# EAGLE design Grove - Mini Track ball v1.0 (EAGLE 7.2.0)

## Sheet 1 of 2
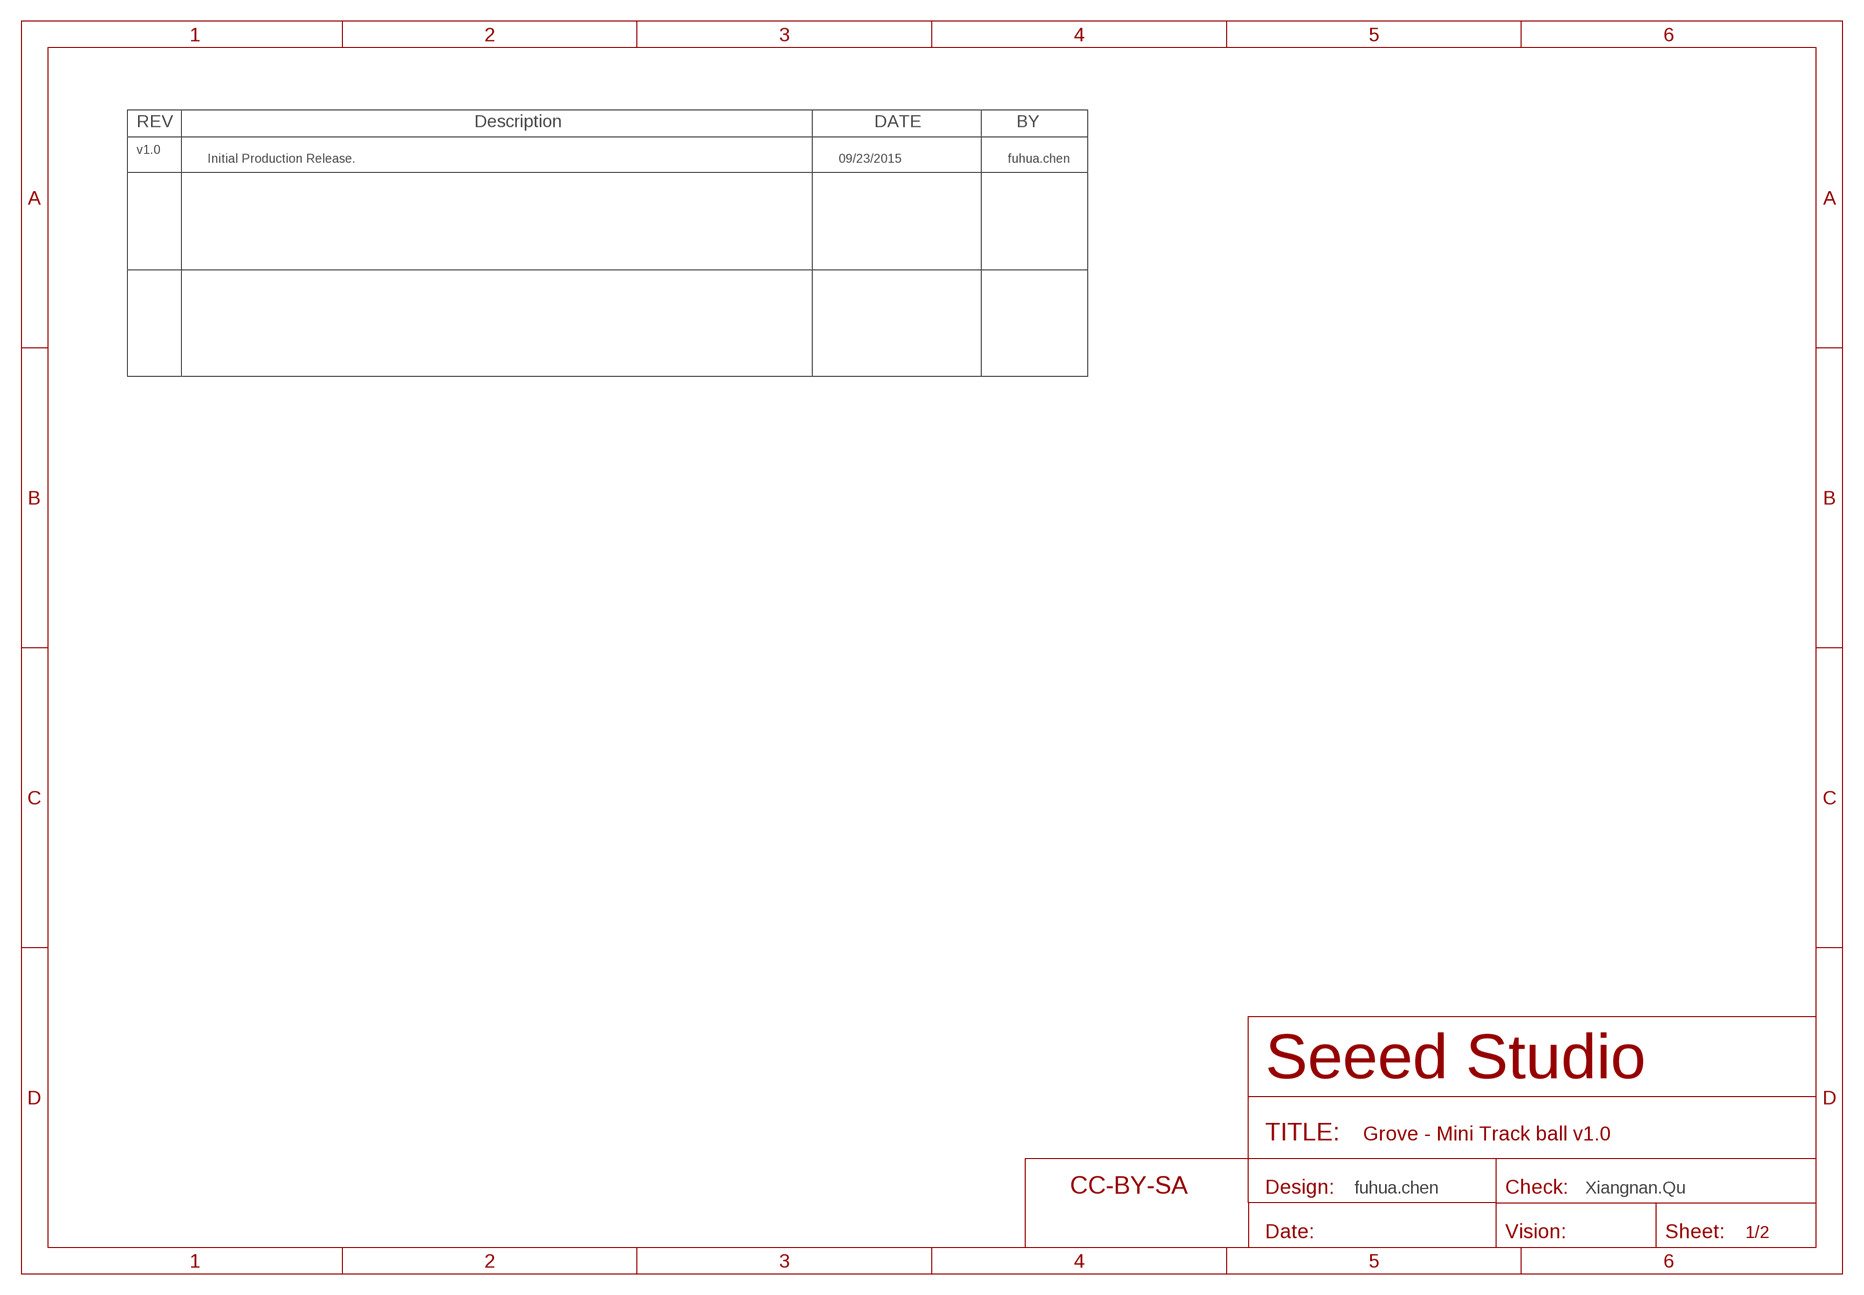
[diagram p0: schematic, sheet 1]

### Parts
U$13  SEEEDSTUDIO-OPEN-SCH-FRAME  [SEEEDSTUDIO-PCB-FRAME]

### Notes on the sheet
- REV | Description | DATE | BY
- v1.0
- Initial Production Release. | 09/23/2015 | fuhua.chen
- fuhua.chen | Xiangnan.Qu

## Sheet 2 of 2
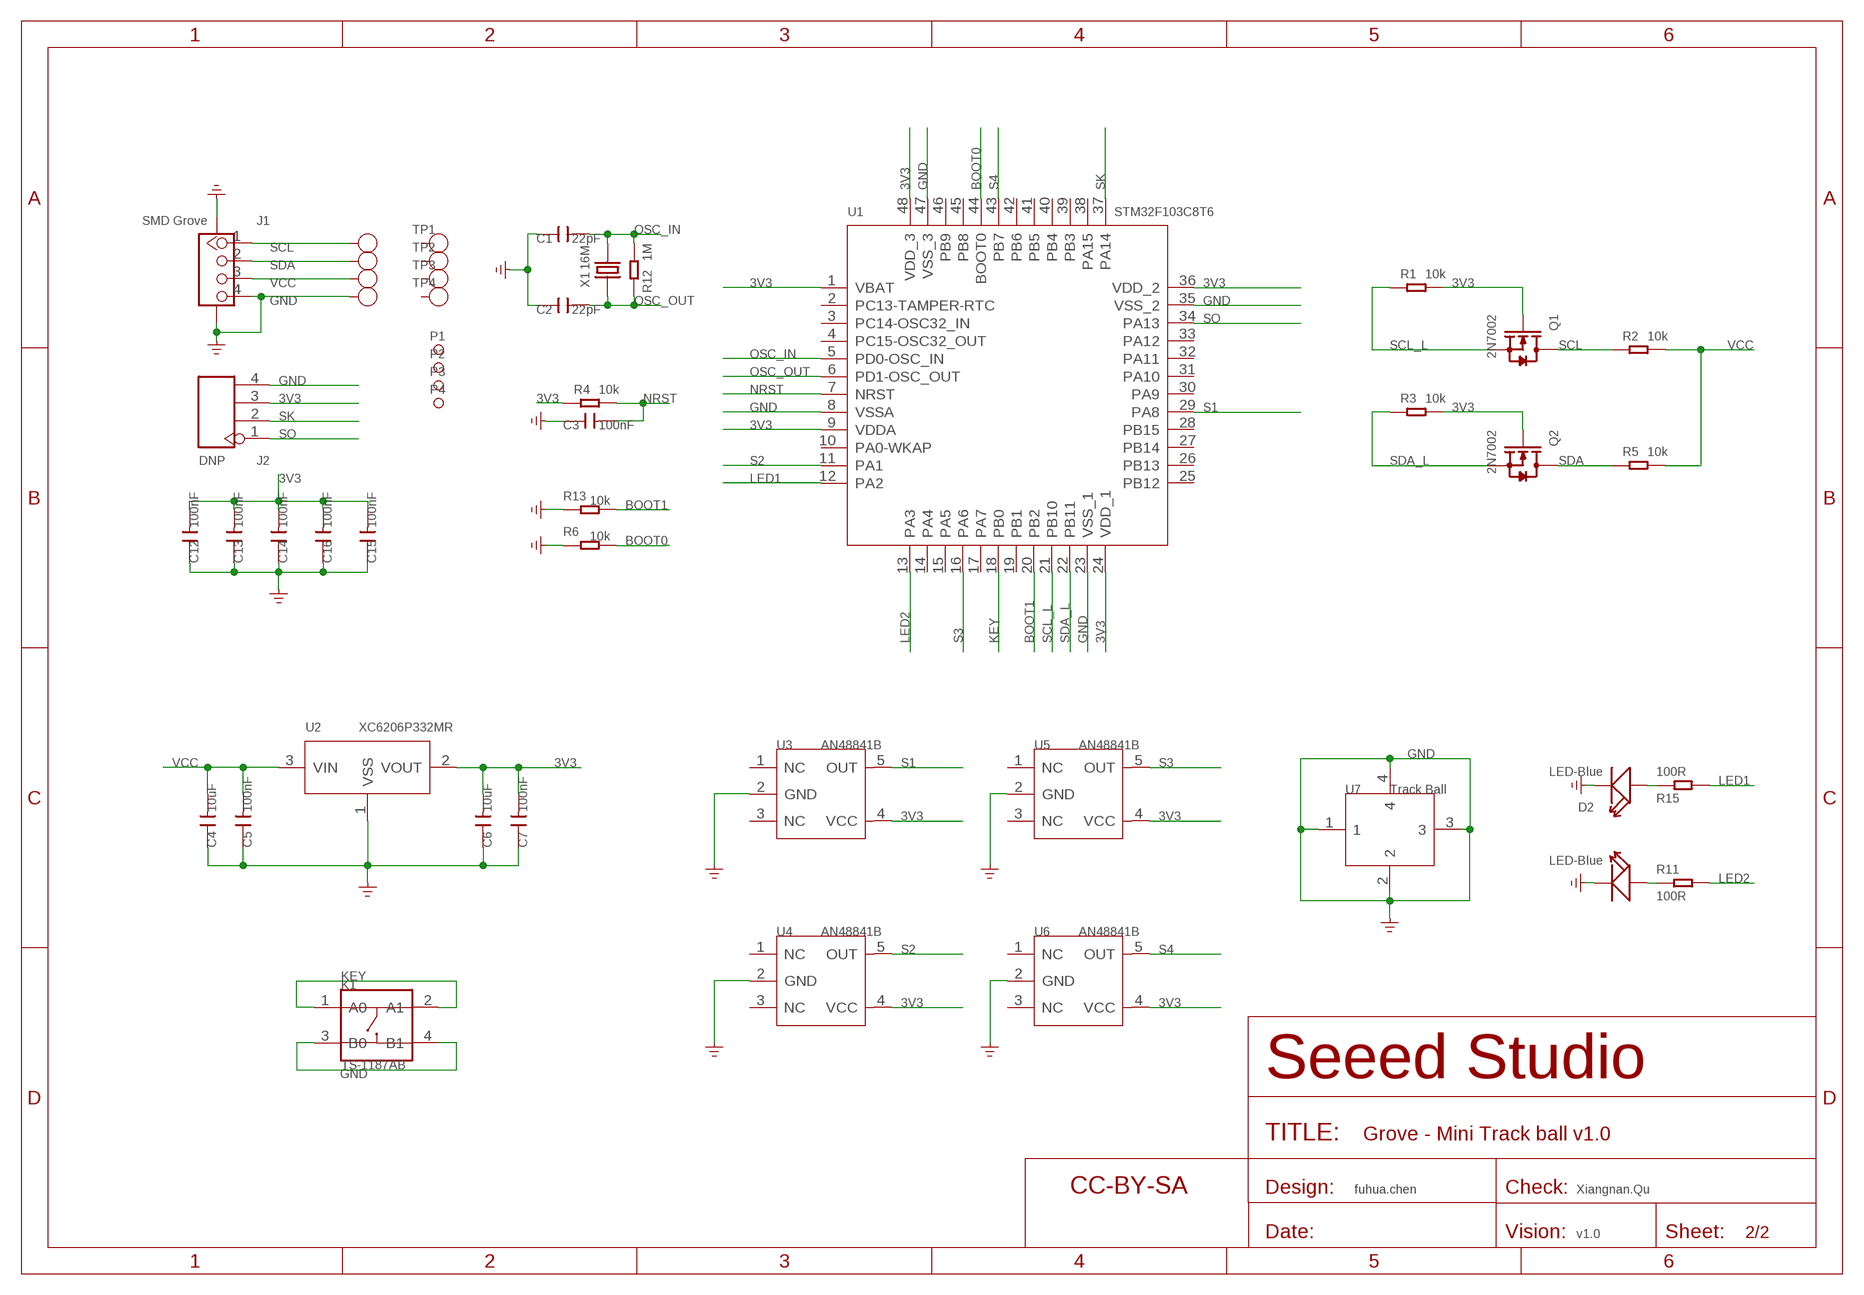
[diagram p1: schematic, sheet 2]

### Parts
C1  22pF  CAP-0402  [C0402]
C2  22pF  CAP-0402  [C0402]
C3  100nF  CAP-0402  [C0402]
C4  10uF  CAP-0402  [C0402]
C5  100nF  CAP-0402  [C0402]
C6  10uF  CAP-0402  [C0402]
C7  100nF  CAP-0402  [C0402]
C12  100nF  CAP-0402  [C0402]
C13  100nF  CAP-0402  [C0402]
C14  100nF  CAP-0402  [C0402]
C15  100nF  CAP-0402  [C0402]
C16  100nF  CAP-0402  [C0402]
D1  LED-Blue  LED'0402'  [LED-0402]
D2  LED-Blue  LED'0402'  [LED-0402]
FR  SEEEDSTUDIO-OPEN-SCH-FRAME  [SEEEDSTUDIO-PCB-FRAME]
GND  GND  TEST-POINT'4545'  [TP-D45MIL]
J1  SMD Grove  GROVE-CONNECTOR-SMD'90D'  [HW4-SMD-2.0-90D]
J2  DNP  HEADER-4P-65/35MIL  [H4-2.54]
K1  TS-1187AB  BUTTON-4P-4.5X4.5  [SW4-4.5X4.5X0.5MM]
P1  MARK-1.0'ANNULAR'  [ROUND-MARK-1.0]
P2  MARK-1.0'ANNULAR'  [ROUND-MARK-1.0]
P3  MARK-1.0'ANNULAR'  [ROUND-MARK-1.0]
P4  MARK-1.0'ANNULAR'  [ROUND-MARK-1.0]
Q1  2N7002  MOSFET-N'SOT23'  [SOT-23]
Q2  2N7002  MOSFET-N'SOT23'  [SOT-23]
R1  10k  RES-0402  [R0402]
R2  10k  RES-0402  [R0402]
R3  10k  RES-0402  [R0402]
R4  10k  RES-0402  [R0402]
R5  10k  RES-0402  [R0402]
R6  10k  RES-0402  [R0402]
R11  100R  RES-0402  [R0402]
R12  1M  RES-0402  [R0402]
R13  10k  RES-0402  [R0402]
R15  100R  RES-0402  [R0402]
SCL  SCL  TEST-POINT'4545'  [TP-D45MIL]
SDA  SDA  TEST-POINT'4545'  [TP-D45MIL]
TP1  TEST-POINT'4545'  [TP-D45MIL]
TP2  TEST-POINT'4545'  [TP-D45MIL]
TP3  TEST-POINT'4545'  [TP-D45MIL]
TP4  TEST-POINT'4545'  [TP-D45MIL]
U1  STM32F103C8T6  MCU-STM32F103CBT6  [LQFP48]
U2  XC6206P332MR  PMIC-XC6206PMR  [SOT-23]
U3  AN48841B  SENSOR-AN48841B  [SMINI-5DE]
U4  AN48841B  SENSOR-AN48841B  [SMINI-5DE]
U5  AN48841B  SENSOR-AN48841B  [SMINI-5DE]
U6  AN48841B  SENSOR-AN48841B  [SMINI-5DE]
U7  Track Ball  TRACK-BALL  [BALL4P-9.1X9.1X6.04MM]
VCC  VCC  TEST-POINT'4545'  [TP-D45MIL]
X1  16M  CRYSTAL-2P'3225'  [X4-SMD-3.2X2.5X0.7MM]

### Nets
3V3: C6.2 C7.2 C12.2 C13.2 C14.2 C15.2 C16.2 J2.3 Q1.1(G) Q2.1(G) R1.2 R3.2 R4.1 U1.1(VBAT) U1.9(VDDA) U1.24(VDD_1) U1.36(VDD_2) U1.48(VDD_3) U2.2(VOUT) U3.4(VCC) U4.4(VCC) U5.4(VCC) U6.4(VCC)
BOOT0: R6.2 U1.44(BOOT0)
BOOT1: R13.2 U1.20(PB2)
GND: C1.1 C2.1 C3.1 C4.1 C5.1 C6.1 C7.1 C12.1 C13.1 C14.1 C15.1 C16.1 D1.- D2.- GND.T J1.4 J1.SS1 J1.SS2 J2.4 K1.3(B0) K1.4(B1) R6.1 R13.1 U1.8(VSSA) U1.23(VSS_1) U1.35(VSS_2) U1.47(VSS_3) U2.1(VSS) U3.2(GND) U4.2(GND) U5.2(GND) U6.2(GND) U7.1 U7.2 U7.3 U7.4 ; supply symbol labelled GND_POWER
KEY: K1.1(A0) K1.2(A1) U1.18(PB0)
LED1: R15.2 U1.12(PA2)
LED2: R11.2 U1.13(PA3)
N$1: D1.+ R11.1
N$4: D2.+ R15.1
NRST: C3.2 R4.2 U1.7(NRST)
OSC_IN: C1.2 R12.2 U1.5(PD0-OSC_IN) X1.4
OSC_OUT: C2.2 R12.1 U1.6(PD1-OSC_OUT) X1.2
S1: U1.29(PA8) U3.5(OUT)
S2: U1.11(PA1) U4.5(OUT)
S3: U1.16(PA6) U5.5(OUT)
S4: U1.43(PB7) U6.5(OUT)
SCL: J1.1 Q1.3(D) R2.1 SCL.T
SCL_L: Q1.2(S) R1.1 U1.21(PB10)
SDA: J1.2 Q2.3(D) R5.1 SDA.T
SDA_L: Q2.2(S) R3.1 U1.22(PB11)
SK: J2.2 U1.37(PA14)
SO: J2.1 U1.34(PA13)
VCC: C4.2 C5.2 J1.3 R2.2 R5.2 U2.3(VIN) VCC.T
Unconnected: TP1.T TP2.T TP3.T TP4.T U1.2(PC13-TAMPER-RTC) U1.3(PC14-OSC32_IN) U1.4(PC15-OSC32_OUT) U1.10(PA0-WKAP) U1.14(PA4) U1.15(PA5) U1.17(PA7) U1.19(PB1) U1.25(PB12) U1.26(PB13) U1.27(PB14) U1.28(PB15) U1.30(PA9) U1.31(PA10) U1.32(PA11) U1.33(PA12) U1.38(PA15) U1.39(PB3) U1.40(PB4) U1.41(PB5) U1.42(PB6) U1.45(PB8) U1.46(PB9) U3.1(NC) U3.3(NC) U4.1(NC) U4.3(NC) U5.1(NC) U5.3(NC) U6.1(NC) U6.3(NC)

### Notes on the sheet
- fuhua.chen | Xiangnan.Qu
- v1.0

## Library data of the parts
C1-C7 C12-C16 = Discrete-new:CAP: Ceramic Capacitors
D1 D2 = Discrete-new:LED
FR U$13 = moudle-new:SEEEDSTUDIO-OPEN-SCH-FRAME
GND SCL SDA TP1-TP4 VCC = Discrete-new:TEST-POINT; PARTNO: DNP
J1 = Connector-new:GROVE-CONNECTOR-SMD: 4P-SMD-2.0:320110030;4P-SMD-2.0-90D:320110032
J2 = Connector-new:HEADER-4P
K1 = Discrete-new:BUTTON-4P: SW4-6.0X6.0X5.0MM:311020024;SW4-8.0X8.0X9.0MM:311020028;SW4-SMD-6.0X6.0X5.0MM:311020004;SW4-SMD-3.35X3.35X1.5MM:311020030;SW4-SMD-5.2X5.2X2.5MM:311020046
P1-P4 = Discrete-new:MARK-1.0; PARTNO: DNP
Q1 Q2 = Discrete-new:MOSFET-N
R1-R6 R11-R13 R15 = Discrete-new:RES
U1 = IC-new:MCU-STM32F103CBT6: 310010004
U2 = IC-new:PMIC-XC6206P: LOW ESR Cap.Compatible Positive Voltage Regulators
U3-U6 = template:SENSOR-AN48841B
U7 = template:TRACK-BALL
X1 = Discrete-new:CRYSTAL-2P

## Board
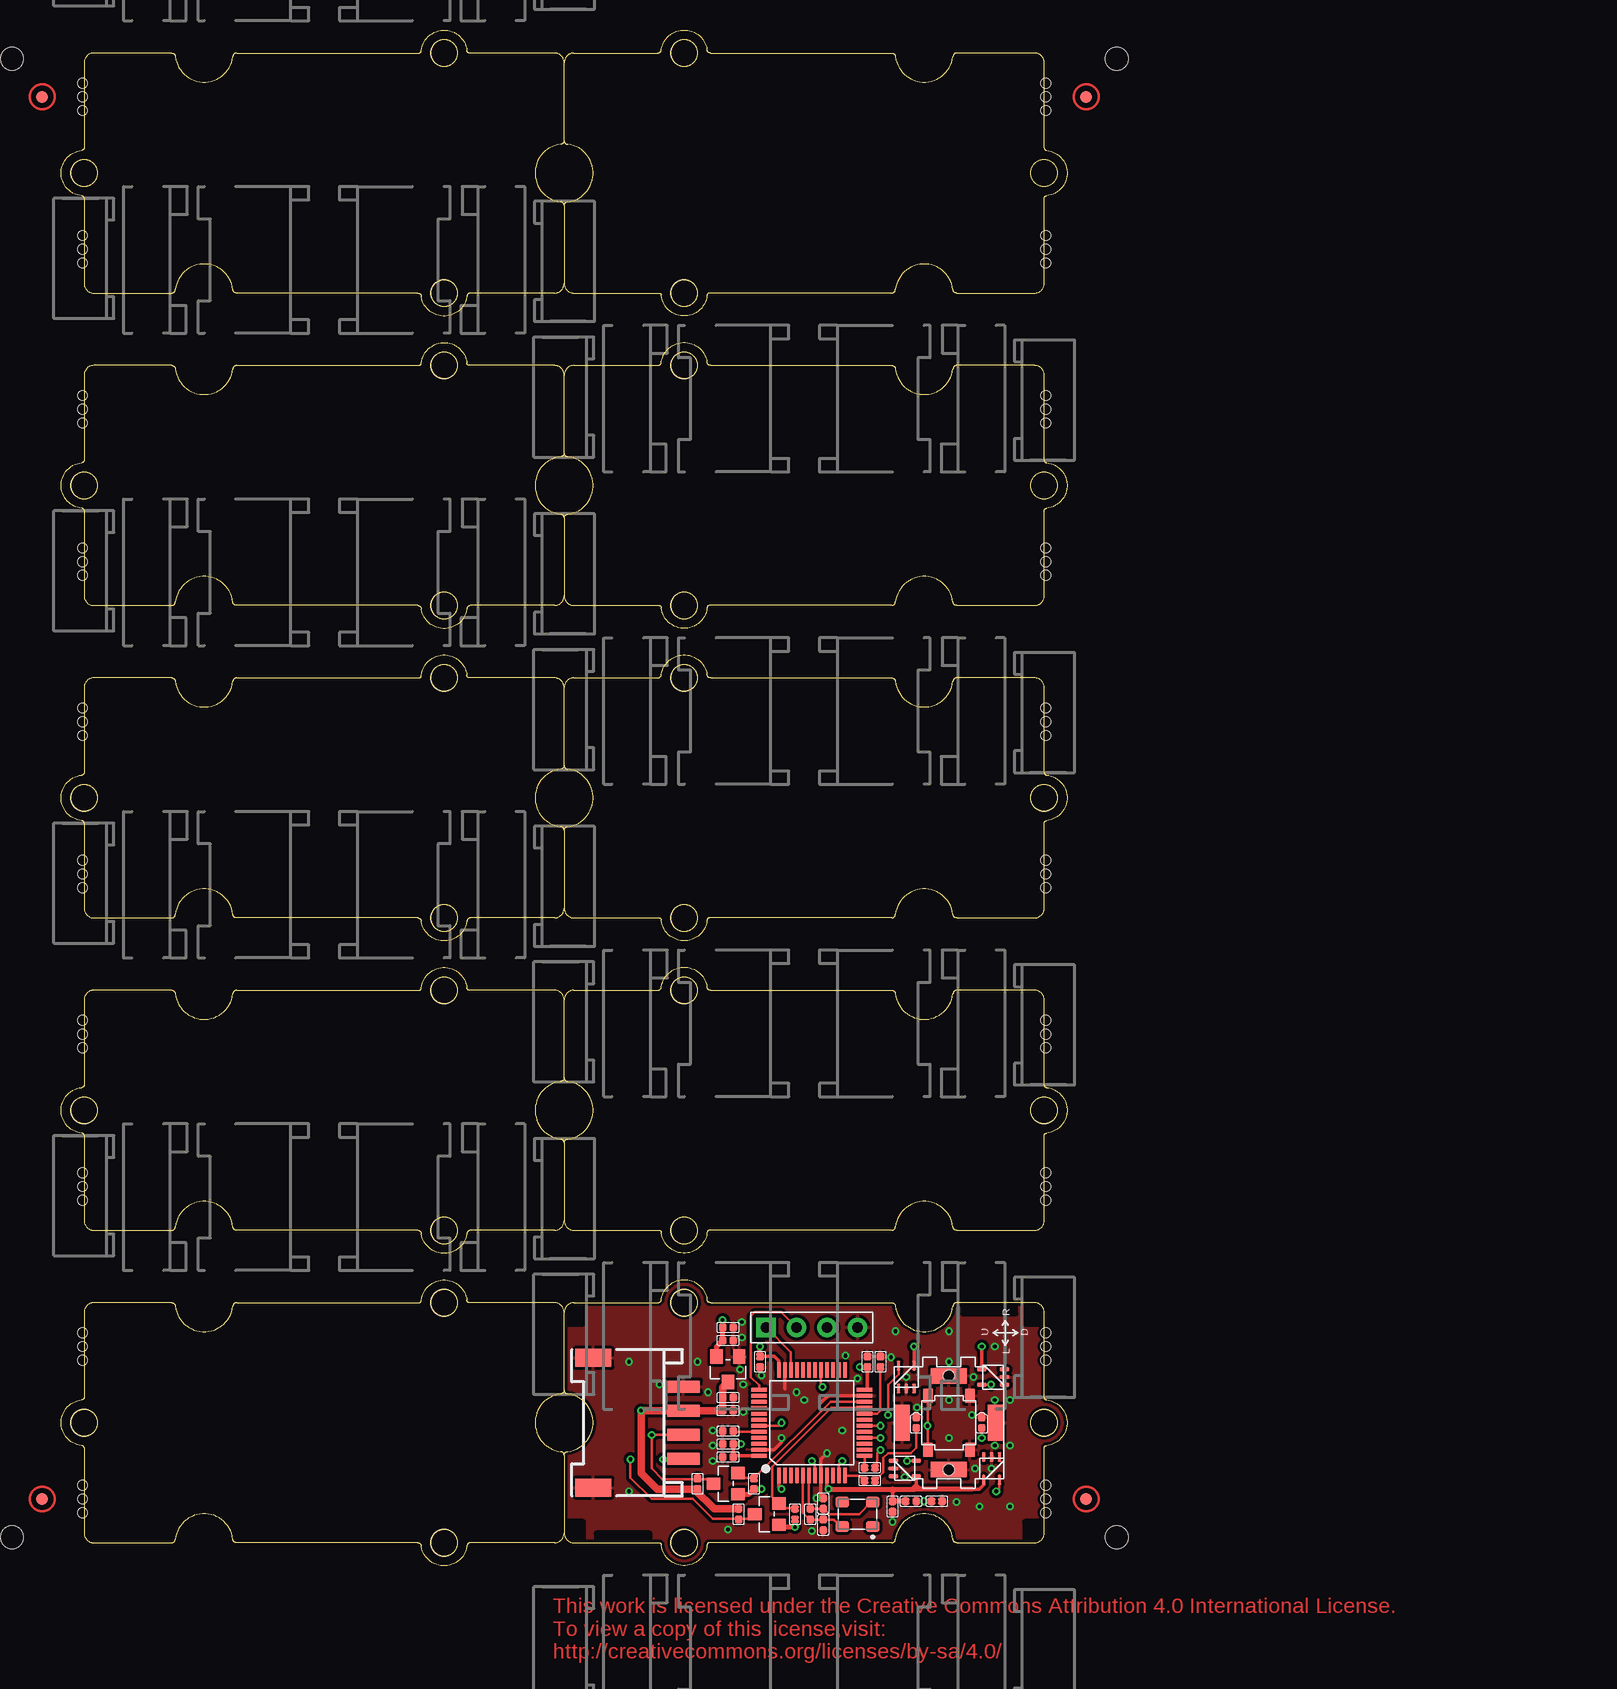
[diagram p2: board, top side]
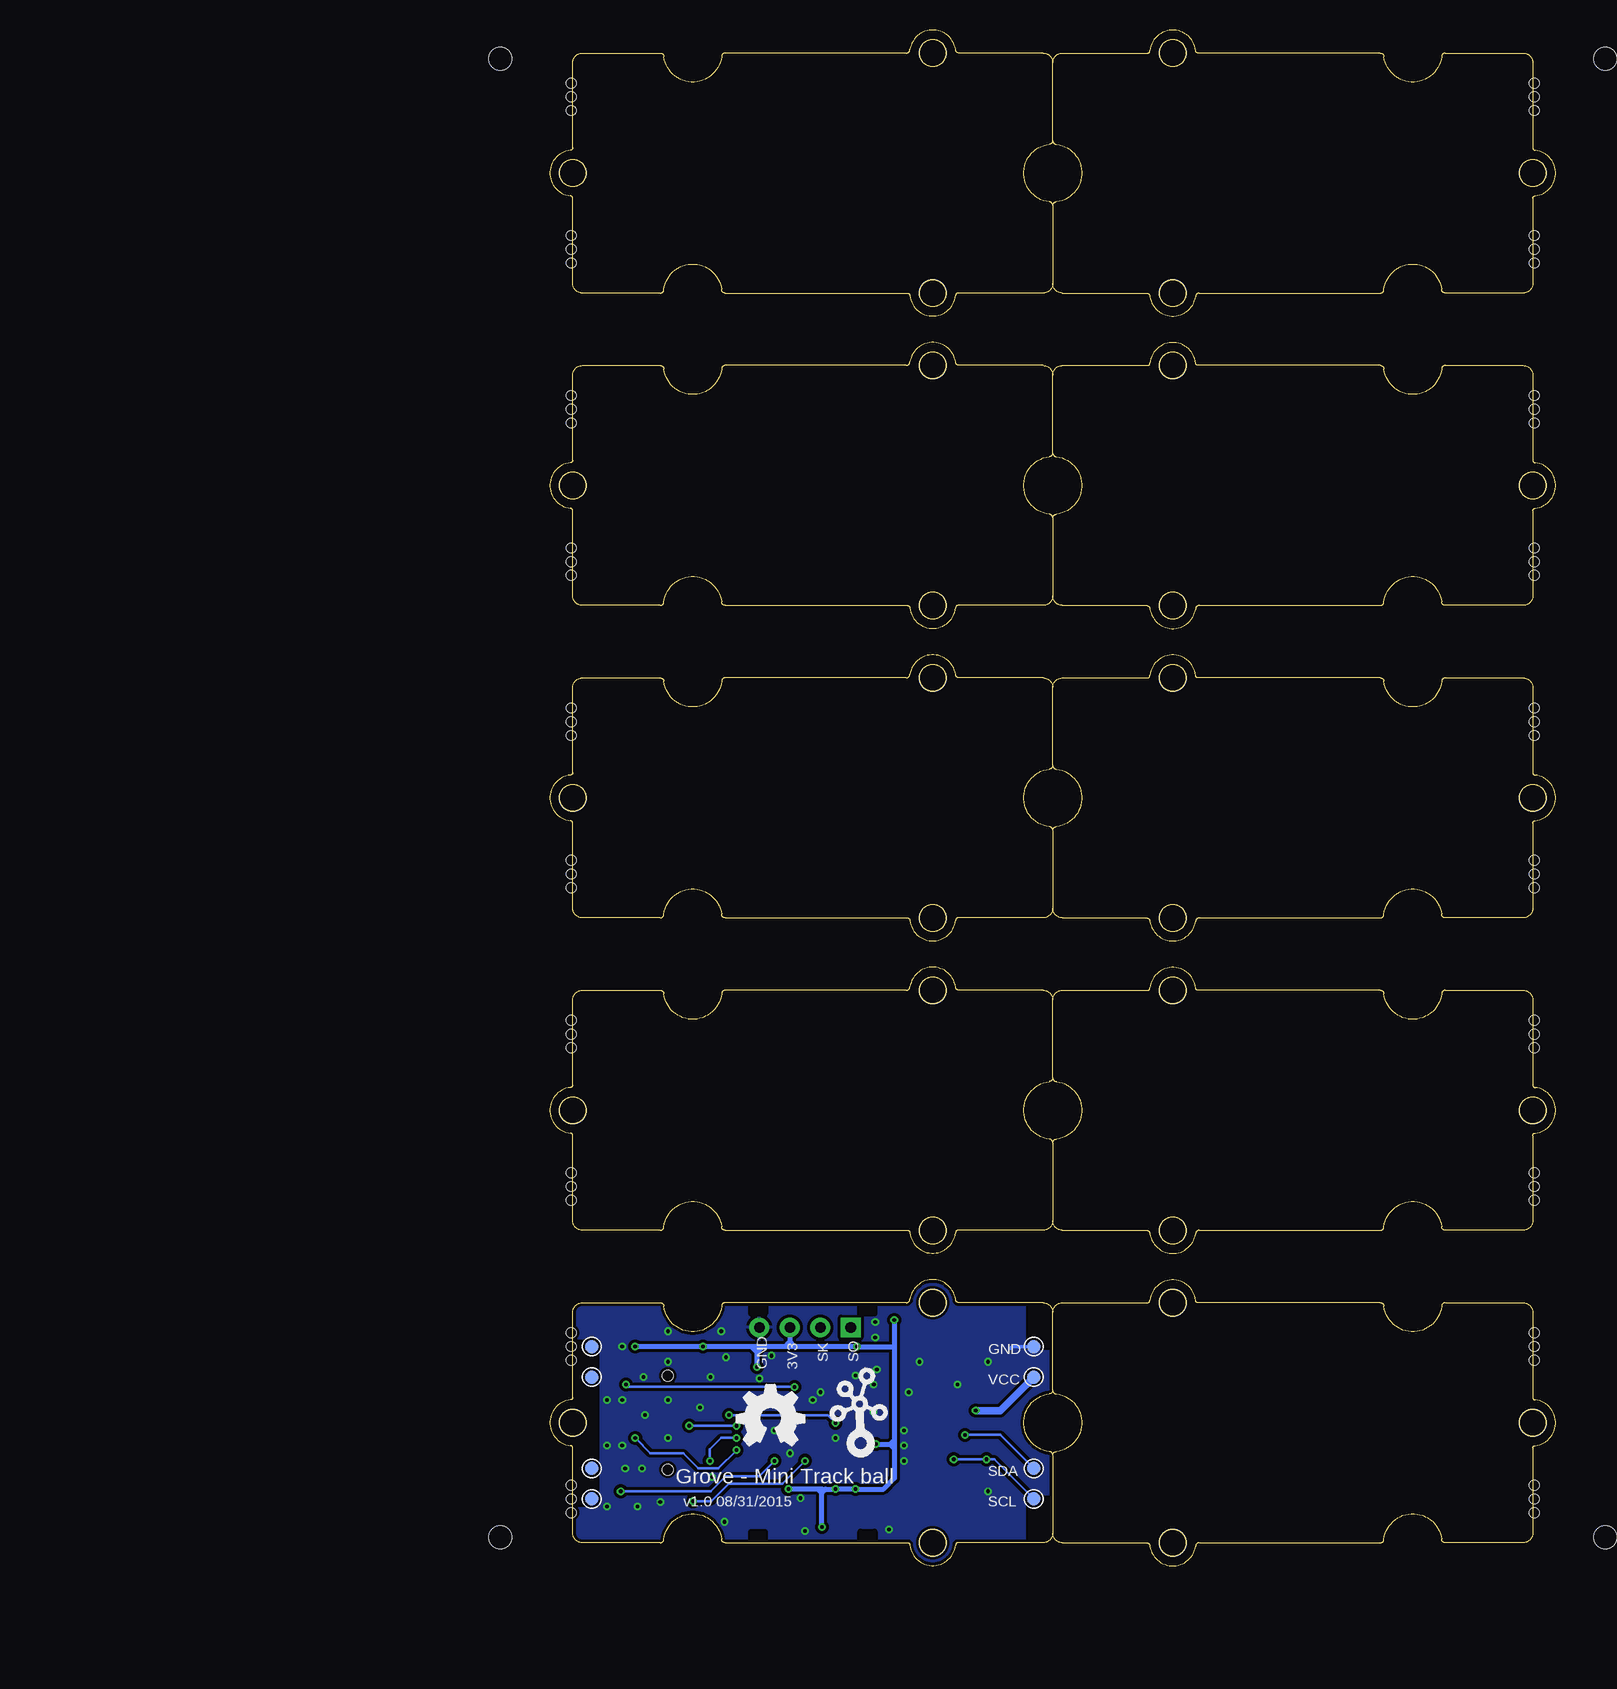
[diagram p3: board, bottom side, seen from below]

Size 83.82 x 127.98 mm. Coordinates in mm from the lower left corner, seen from the top.
Copper layers (1*16): Top 0.035mm / dielectric 1.5mm / Bottom 0.035mm
Design rules "SeeedStudio_2layer_DRU_no_angle_20140221 *": minimum track width 6mil, minimum drill 12mil, track to track 6mil, track to pad 6mil, pad to pad 6mil, via to via 6mil, smd to smd 0mil, copper to edge 10mil, drill to drill 10mil, minimum pad ring 10mil, minimum via ring 6mil, stop-mask expansion 2mil, vias tented up to drill 25mil, thermal gap 10mil
Holes 0.8 mm at 1.78,123.55 1.78,121.27 1.78,122.41 1.78,110.85 1.78,108.57 1.78,109.71 1.78,97.52 1.78,95.23 1.78,96.38 1.78,84.82 1.78,82.53 1.78,83.68 1.78,71.48 1.78,69.2 1.78,70.34 1.78,58.78 1.78,56.5 1.78,57.64 1.78,45.45 1.78,43.16 1.78,44.31 1.78,32.75 1.78,30.46 1.78,31.61 1.78,19.41 1.78,17.13 1.78,18.27 1.78,6.71 1.78,4.43 1.78,5.57 82.04,121.27 82.04,123.55 82.04,122.41 82.04,108.57 82.04,110.85 82.04,109.71 82.04,95.23 82.04,97.52 82.04,96.38 82.04,82.53 82.04,84.82 82.04,83.68 82.04,69.2 82.04,71.48 82.04,70.34 82.04,56.5 82.04,58.78 82.04,57.64 82.04,43.16 82.04,45.45 82.04,44.31 82.04,30.46 82.04,32.75 82.04,31.61 82.04,17.13 82.04,19.41 82.04,18.27 82.04,4.43 82.04,6.71 82.04,5.57
Holes 1.91 mm at -4.13,2.4 87.95,2.4 87.95,125.59 -4.13,125.59

### Footprints (pad centres in the part's own frame; a part is rotated, then mirrored left to right if it is on the bottom)
C0402 = smd 0.635 x 0.635: 1 0,0.445; 2 0,-0.445
LED-0402 = smd 0.635 x 0.635: + -0.445,0; - 0.445,0
TP-D45MIL = smd 1.143 x 1.143: T 0,0
HW4-SMD-2.0-90D = smd 1.01 x 2.74: 1 -3,-0.1; 2 -1,-0.1; 3 1,-0.1; 4 3,-0.1 | smd 1.5 x 3: SS1 -5.4,7.4; SS2 5.4,7.4
H4-2.54 = drill 0.889 pad 1.651 square: 1 0,3.81 | drill 0.889 pad 1.651: 2 0,1.27; 3 0,-1.27; 4 0,-3.81
SW4-4.5X4.5X0.5MM = smd 1.2 x 0.8: 1 -2.25,1.75; 2 2.25,1.75; 3 -2.25,-1.75; 4 2.25,-1.75
ROUND-MARK-1.0 = smd 1.016 x 1.016: P$1 0,0
SOT-23 = smd 1.016 x 1.143: 1 -0.889,-1.016; 2 0.889,-1.016; 3 0,1.016
R0402 = smd 0.635 x 0.635: 1 0,0.445; 2 0,-0.445
LQFP48 = smd 1.3 x 0.3: 1 -4.4,2.75; 2 -4.4,2.25; 3 -4.4,1.75; 4 -4.4,1.25; 5 -4.4,0.75; 6 -4.4,0.25; 7 -4.4,-0.25; 8 -4.4,-0.75; 9 -4.4,-1.25; 10 -4.4,-1.75; 11 -4.4,-2.25; 12 -4.4,-2.75; 25 4.4,-2.75; 26 4.4,-2.25; 27 4.4,-1.75; 28 4.4,-1.25; 29 4.4,-0.75; 30 4.4,-0.25; 31 4.4,0.25; 32 4.4,0.75; 33 4.4,1.25; 34 4.4,1.75; 35 4.4,2.25; 36 4.4,2.75 | smd 0.3 x 1.3: 13 -2.75,-4.4; 14 -2.25,-4.4; 15 -1.75,-4.4; 16 -1.25,-4.4; 17 -0.75,-4.4; 18 -0.25,-4.4; 19 0.25,-4.4; 20 0.75,-4.4; 21 1.25,-4.4; 22 1.75,-4.4; 23 2.25,-4.4; 24 2.75,-4.4; 37 2.75,4.4; 38 2.25,4.4; 39 1.75,4.4; 40 1.25,4.4; 41 0.75,4.4; 42 0.25,4.4; 43 -0.25,4.4; 44 -0.75,4.4; 45 -1.25,4.4; 46 -1.75,4.4; 47 -2.25,4.4; 48 -2.75,4.4
SOT-23' = smd 1.016 x 1.2: 1 -0.95,-1.06; 2 0.95,-1.06; 3 0,1.06
SMINI-5DE = smd 0.3 x 0.8: 1 -0.65,-0.95; 2 0,-0.95; 3 0.65,-0.95; 4 0.65,0.95; 5 -0.65,0.95
BALL4P-9.1X9.1X6.04MM = smd 1.3 x 3: 1 -3.9,0; 3 3.9,0 | smd 3 x 1.3: 2 0,-3.9; 4 0,3.9 | hole 0.9: -3.9,0; 3.9,0
GROVE-1*2-TEST-PLATFORM = hole 2.2: 10.635,10; 10.635,-10; -19.365,0
X4-SMD-3.2X2.5X0.7MM = smd 1.143 x 0.889: 1 -1.27,1.016; 2 -1.27,-1.016; 3 1.27,-1.016; 4 1.27,1.016

### Placement (x,y rotation side)
C1  63.5,3.41 180 top
C2  63.5,5.19 0 top
C3  72.96,5.38 270 top
C4  55.56,14.02 270 top
C5  55.56,12.94 270 top
C6  55.56,18.78 270 top
C7  55.56,19.86 270 top
C12  55.56,9.06 90 top
C13  67.18,17 0 top
C14  55.56,10.14 90 top
C15  58.23,17 180 top
C16  69.28,4.94 180 top
D1  76.71,11.92 90 top
D2  71.25,11.92 90 top
FR  40.96,-7.76 0 top  (outside the outline)
GND  43.5,18.27 180 bottom
J1  51.75,11.92 90 top
J2  62.55,19.86 90 top
K1  73.98,11.92 90 top
P1  -1.59,5.57 0 top
P2  85.41,5.57 0 top
P3  85.41,122.41 0 top
P4  -1.59,122.41 0 top
Q1  58.8,4.3 90 top
Q2  55.37,6.84 90 top
R1  61.15,4.3 0 top
R2  56.45,4.3 180 top
R3  57.72,6.84 0 top
R4  70.8,5.38 90 top
R5  53.02,6.84 0 top
R6  55.56,11.22 90 top
R11  67.37,8.17 270 top
R12  62.42,4.3 0 top
R13  68.26,17 0 top
R15  67.37,7.1 270 top
SCL  43.5,5.57 180 bottom
SDA  43.5,8.11 180 bottom
TP1  80.33,18.27 0 bottom
TP2  80.33,15.73 0 bottom
TP3  80.33,8.11 0 bottom
TP4  80.33,5.57 0 bottom
U1  62.55,11.92 90 top
U2  XC6206P332MR  [SOT-23']  55.56,16.37 180 top
U3  77.66,15.73 90 top
U4  77.53,8.11 180 top
U5  70.3,8.11 270 top
U6  70.42,15.73 0 top
U7  73.98,11.92 90 top
U$1  [GROVE-1*2-TEST-PLATFORM]  62.55,11.92 180 top
U$2  [GROVE-1*2-TEST-PLATFORM]  21.27,11.92 0 top
U$3  [GROVE-1*2-TEST-PLATFORM]  21.27,37.96 0 top
U$4  [GROVE-1*2-TEST-PLATFORM]  21.27,63.99 0 top
U$5  [GROVE-1*2-TEST-PLATFORM]  21.27,90.03 0 top
U$6  [GROVE-1*2-TEST-PLATFORM]  21.27,116.06 0 top
U$7  [GROVE-SILK-BIG]  57.98,10.02 0 bottom
U$8  [OSHW_FILLX200_NOTEXT]  68.26,10.02 0 bottom
U$9  [GROVE-1*2-TEST-PLATFORM]  62.55,116.06 180 top
U$10  [GROVE-1*2-TEST-PLATFORM]  62.55,90.03 180 top
U$11  [GROVE-1*2-TEST-PLATFORM]  62.55,63.99 180 top
U$12  [GROVE-1*2-TEST-PLATFORM]  62.55,37.96 180 top
U$13  -14.16,-21.48 0 top  (outside the outline)
VCC  43.5,15.73 180 bottom
X1  66.36,4.3 180 top

### Tracks (layer width: path | path; a pad name or v marks a point on that pad's centre or on a via)
3V3  (via drill 0.3 pad 0.64)
  Top 0.305: U1.48 56.12,9.17 C12.2 C14.2 | U1.36 59.8,17.08 59.44,17.45 C15.2 | U1.1 59.8,6.61 v60.01,6.4 | U1.9 63.8,6.54 v63.95,6.4 | U4.4 76.88,6.76 76.52,6.4 75.88,6.4 | U5.4 71.25,6.78 | 71.25,6.78 71.25,6.46 71.18,6.4 | C16.2 69.28,6.08 | 69.28,6.08 69.28,6.4 | 69.28,6.08 69.03,6.33 | 69.28,6.08 69.53,6.33 | 71.25,6.78 71.18,6.71 | 71.18,6.71 70.93,6.46 | 71.18,6.71 71.31,6.71 71.57,6.46 | v76.71,18.27 U3.4 | U6.4 71.07,18.26 v71.06,18.27 | C13.2 67.18,14.78 67.08,14.67 U1.24
  Top 0.406: U2.2 54.61,18.27 C6.2 C7.2 v55.12,20.49 | C15.2 v58.23,18.27 | v66.55,16.56 C13.2 | v56.64,10.14 C14.2 | Q2.1 57.28,5.95 R3.2 v58.36,6.4 | R1.2 v61.15,3.22 60.01,3.22 Q1.1 | v63.95,6.4 69.28,6.4 71.18,6.4 75.88,6.4 | R4.1 C16.2
  Bottom 0.406: 63.44,18.27 v58.23,18.27 55.12,18.27 | 63.44,18.27 63.82,18.27 | J2.3 63.82,18.65 | 63.82,18.65 63.82,18.27 | v55.12,20.49 55.12,18.27 | 55.12,18.27 55.12,10.14 | 55.12,10.14 55.12,7.29 56.01,6.4 v58.36,6.4 v60.01,6.4 60.83,6.4 | v61.15,3.22 61.15,6.08 | 61.15,6.08 61.15,6.4 | 61.15,6.4 60.83,6.4 | 61.15,6.4 v63.95,6.4 | v56.64,10.14 55.44,10.14 | 55.44,10.14 55.12,10.14 | 63.82,18.27 64.2,18.27 | 64.2,18.27 66.1,18.27 | 66.1,18.27 66.49,18.27 | 66.49,18.27 66.99,18.27 | 66.99,18.27 v71.06,18.27 v76.71,18.27 | v66.55,16.56 66.55,18.21 66.49,18.27 | 60.83,6.4 61.15,6.08 | 61.15,6.08 61.41,6.33 | 64.2,18.27 63.82,18.65 | 63.82,18.65 63.44,18.27 | 66.1,18.27 66.49,17.89 66.61,17.89 66.99,18.27 | 55.44,10.14 55.18,10.4 55.18,9.89 55.44,10.14
BOOT0
  Top 0.203: U1.44 56.06,11.17 R6.2
BOOT1
  Top 0.203: R13.2 68.26,12.94 68,12.67 U1.20
GND  (via drill 0.3 pad 0.64)
  Top 0.305: U1.35 60.3,14.75 | U1.23 63.91,14.17 63.31,13.57 | U1.47 59.41,9.67 60.01,10.27 | v63.82,9.38 63.3,8.86 U1.8 63.3,5.84 C2.1
  Bottom 0.305: GND.T 45.28,18.27 45.4,18.14
  other vias: 56.58,16.37 58.36,15.86 61.28,14.46 60.01,10.65 61.91,13.83 66.36,15.6 70.42,15.73 69.15,17.38 65.34,17.51 56.83,15.1 56.83,12.81 54.29,11.29 54.29,10.02 54.29,8.75 71.31,13.19 75.88,12.56 76.01,15.73 77.53,8.11 70.3,7.41 69.28,3.67 62.55,2.9 65.09,11.29 62.93,5.63 49.85,15.1 53.91,14.46 53.02,17 47.31,17 47.31,6.21 56.71,19.03 56.71,20.3 69.53,19.54 73.98,19.54 77.79,18.27 79.06,13.83 79.06,10.02 74.61,5.32 76.52,4.94 76.14,8.11 79.06,4.94 73.98,13.83 73.98,10.65 73.98,17 77.79,13.83 77.79,10.02 55.56,3.03
  pour Bottom (isolate 0.254): 41.59,-0.02 84.14,-0.02 84.14,24.11 41.59,24.11
  pour Top (isolate 0.254): 41.59,-0.02 84.14,-0.02 84.14,24.11 41.59,24.11
KEY  (via drill 0.3 pad 0.64)
  Top 0.203: v68.26,11.67 U1.18 | K1.1 72.23,11.67 | 72.23,11.67 K1.2 | v72.2,11.67 72.23,11.67
  Bottom 0.203: v72.2,11.67 v68.26,11.67
LED1
  Top 0.203: U1.12 66.5,7.52 R15.2
LED2
  Top 0.203: U1.13 66.95,8.19 R11.2
N$1  (via drill 0.3 pad 0.64)
  Top 0.203: D1.+ v76.71,10.65 | R11.1 68.01,8.37 68.01,9.38 v68.26,9.64
  Bottom 0.203: v68.26,9.64 69.79,8.11 71.44,8.11 72.71,9.38 75.44,9.38 v76.71,10.65
N$4
  Top 0.203: R15.1 68.52,7.79 68.52,9 68.9,9.38 70.8,9.38 71.25,9.83 D2.+
NRST  (via drill 0.3 pad 0.64)
  Top 0.203: C3.2 R4.2 v71.88,5.38 | U1.7 62.8,8.5 v62.55,8.75
  Bottom 0.203: v71.88,5.38 70.36,5.38 68.9,6.84 64.45,6.84 v62.55,8.75
OSC_IN
  Top 0.203: U1.5 61.8,4.42 62.29,3.92 62.36,3.92 R12.2 C1.2 64.39,3.86 64.71,3.54 64.83,3.54 X1.4
OSC_OUT
  Top 0.203: U1.6 62.3,4.87 R12.1 C2.2 63.56,4.68 63.63,4.68 64.01,4.3 66.49,4.3 67.5,5.32 X1.2
S1  (via drill 0.3 pad 0.64)
  Top 0.203: U3.5 77.46,15.08 v77.47,15.1 | U1.29 63.3,15.04 v63.44,14.91
  Bottom 0.203: v63.44,14.91 77.28,14.91 v77.47,15.1
S2  (via drill 0.3 pad 0.64)
  Top 0.203: U4.5 78.18,6.48 v77.92,6.21 | U1.11 64.8,8.46 v65.09,8.75
  Bottom 0.203: v77.92,6.21 70.42,6.21 69.15,7.48 66.36,7.48 v65.09,8.75
S3  (via drill 0.3 pad 0.64)
  Top 0.203: v68.26,10.65 66.97,10.65 U1.16 | v70.49,8.75 71.23,8.75 U5.5
  Bottom 0.203: v68.26,10.65 69.53,10.65 70.49,9.7 v70.49,8.75
S4  (via drill 0.3 pad 0.64)
  Top 0.203: U6.5 69.77,15.97 68.9,15.1 v68.9,12.56 | U1.43 59.76,11.67 v60.01,11.92
  Bottom 0.203: v68.9,12.56 60.64,12.56 v60.01,11.92
SCL  (via drill 0.3 pad 0.64)
  Top 0.203: v50.17,8.87 51.81,8.87 J1.1 | R2.1 56.45,3.92 | 56.45,3.92 57.4,3.92 Q1.3 | 56.45,3.92 54.29,3.92 52.64,5.57 49.21,5.57 47.44,7.35 v47.44,8.87
  Bottom 0.203: v50.17,8.87 v47.44,8.87 46.8,8.87 SCL.T
SCL_L
  Top 0.203: U1.21 64.18,13.17 59.25,8.24 59.25,5.76 Q1.2 59.88,5.13 59.88,4.94 60.01,4.81 61.15,4.81 R1.1
SDA  (via drill 0.3 pad 0.64)
  Top 0.203: 53.02,7.22 53.02,7.1 | R5.1 53.02,7.22 | 53.02,7.22 54.17,7.22 54.29,7.1 54.29,6.91 Q2.3 54.17,6.84 | J1.2 51.84,10.91 v49.21,10.91 49.21,8.11 50.1,7.22 53.02,7.22
  Bottom 0.203: v49.21,10.91 46.29,10.91 SDA.T
SDA_L
  Top 0.203: Q2.2 56.77,7.35 57.72,7.35 R3.1 64.11,13.67 U1.22
SK
  Top 0.203: J2.2 60.01,21.13 57.79,21.13 57.47,20.81 57.47,15.73 58.15,15.05 U1.37
SO
  Top 0.203: U1.34 60.8,17.8 J2.1
VCC  (via drill 0.3 pad 0.64)
  Top 0.61: R5.2 52.77,6.4 | U2.3 55.12,14.86 C4.2 C5.2 55.1,12.92 J1.3 51.84,12.94 v48.32,12.94 48.32,7.73 49.66,6.4 52.77,6.4 | R2.2 54.42,4.75 52.77,6.4
  Bottom 0.61: VCC.T 46.29,12.94 v48.32,12.94

### Text on the board
tPlace: R | U | D | L
bPlace: GND | SO | SK | 3V3 | GND | VCC | SDA | Grove - Mini Track ball | SCL | v1.0 08/31/2015